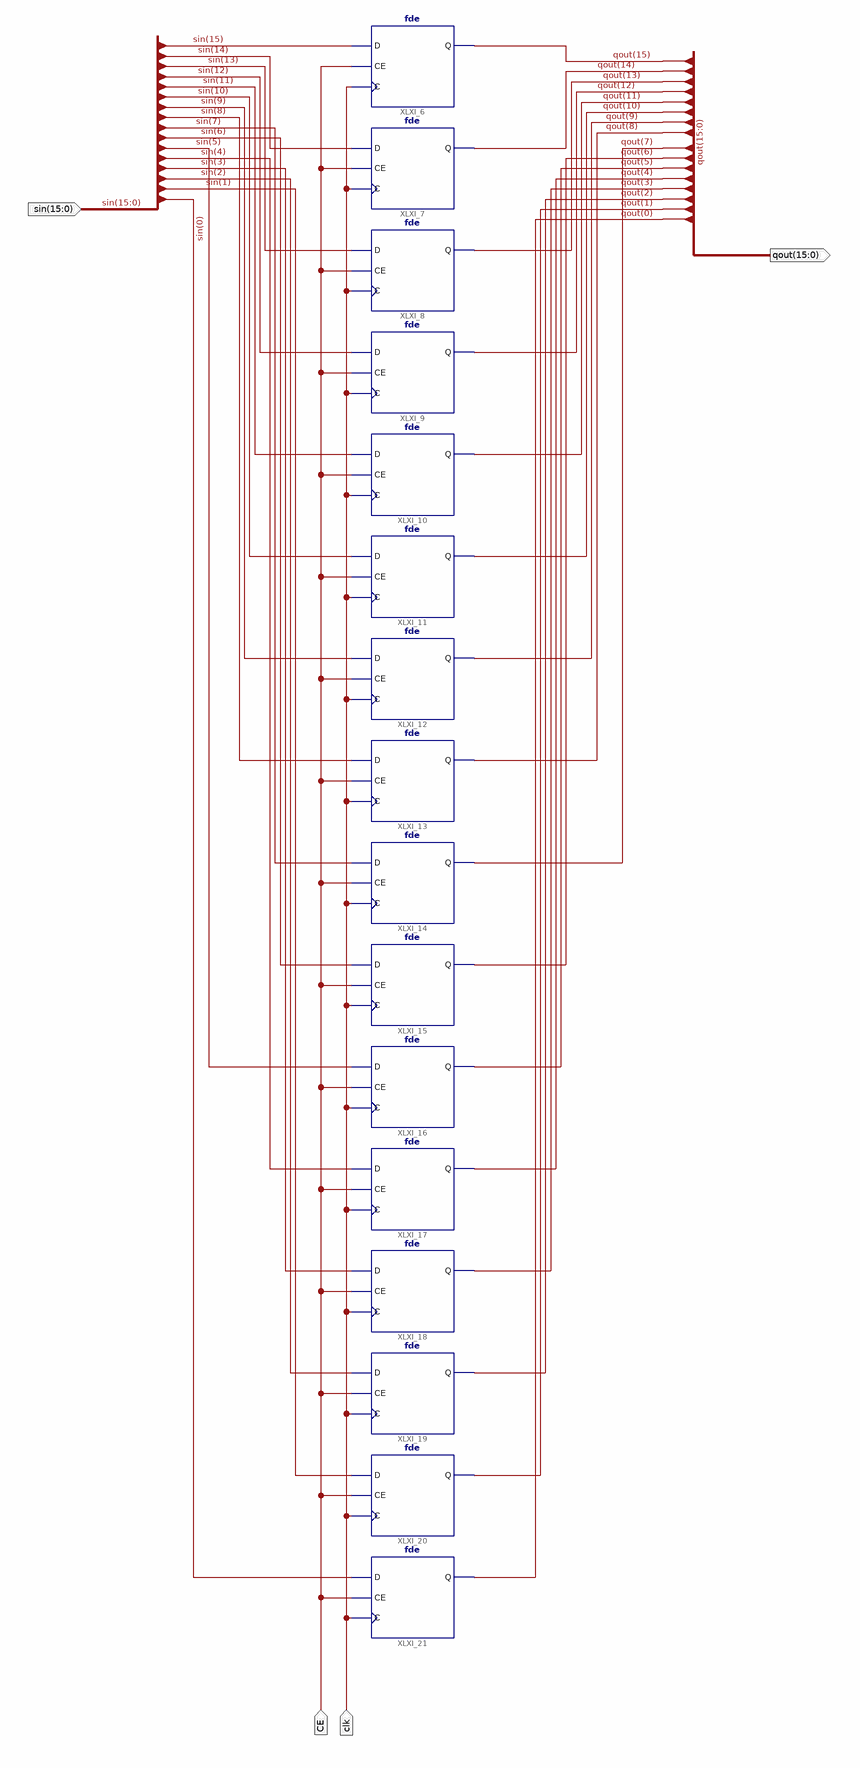
[diagram p0: schematic sheet 1]
// Xilinx ISE schematic D_filp_flop_regwce.sch (spartan3e) as structural Verilog: 16 symbols, 4 ports
module D_filp_flop_regwce (
  input  [15:0] sin,
  input  clk,
  input  CE,
  output [15:0] qout
);

  fde XLXI_6 (.C(clk), .CE(CE), .D(sin[15]), .Q(qout[15]));
  fde XLXI_7 (.C(clk), .CE(CE), .D(sin[14]), .Q(qout[14]));
  fde XLXI_8 (.C(clk), .CE(CE), .D(sin[13]), .Q(qout[13]));
  fde XLXI_9 (.C(clk), .CE(CE), .D(sin[12]), .Q(qout[12]));
  fde XLXI_10 (.C(clk), .CE(CE), .D(sin[11]), .Q(qout[11]));
  fde XLXI_11 (.C(clk), .CE(CE), .D(sin[10]), .Q(qout[10]));
  fde XLXI_12 (.C(clk), .CE(CE), .D(sin[9]), .Q(qout[9]));
  fde XLXI_13 (.C(clk), .CE(CE), .D(sin[8]), .Q(qout[8]));
  fde XLXI_14 (.C(clk), .CE(CE), .D(sin[7]), .Q(qout[7]));
  fde XLXI_15 (.C(clk), .CE(CE), .D(sin[6]), .Q(qout[6]));
  fde XLXI_16 (.C(clk), .CE(CE), .D(sin[5]), .Q(qout[5]));
  fde XLXI_17 (.C(clk), .CE(CE), .D(sin[4]), .Q(qout[4]));
  fde XLXI_18 (.C(clk), .CE(CE), .D(sin[3]), .Q(qout[3]));
  fde XLXI_19 (.C(clk), .CE(CE), .D(sin[2]), .Q(qout[2]));
  fde XLXI_20 (.C(clk), .CE(CE), .D(sin[1]), .Q(qout[1]));
  fde XLXI_21 (.C(clk), .CE(CE), .D(sin[0]), .Q(qout[0]));
endmodule
